# Altium schematic sheet Connector 2.SchDoc
size A4; SheetNumber: 7; SheetTotal: 12
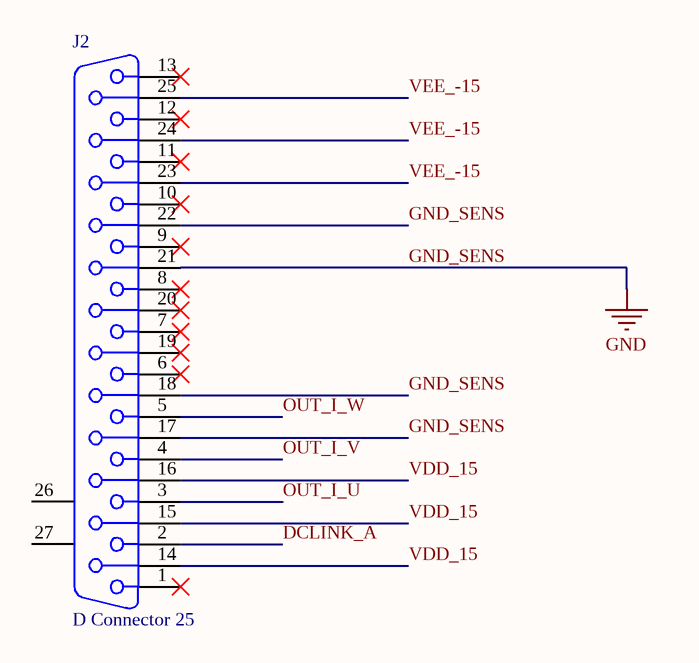
[diagram p0: Connector 2.SchDoc]

## Parts
J2  D Connector 25  [DSUB1.385-2H25A]

## Nets
GND_SENS: J2.17 J2.18 J2.21 J2.22  [also labelled GND]
DCLINK_A: J2.2
OUT_I_U: J2.3
OUT_I_V: J2.4
OUT_I_W: J2.5
VDD_15: J2.14 J2.15 J2.16
VEE_-15: J2.23 J2.24 J2.25

Not connected (* = marked no-connect by the designer): J2 1* 6* 7* 8* 9* 10* 11* 12* 13* 19* 20* 26(MH1) 27(MH2)

## Library data of the parts
J2 = D Connector 25: Receptacle Assembly, 25 Position, Right Angle; PackageDocument: U; Positions: 25; Published: 15-Jun-2001; LatestRevisionDate: 17-Jul-2002; LatestRevisionNote: Re-released for DXP Platform.; DatasheetDocument: 19-Mar-1999; PackageReference: 787202; Publisher: Altium Limited; Orientation: Right Angle; Gender: Receptacle